# Altium project miniBackplane_test.PrjPCB
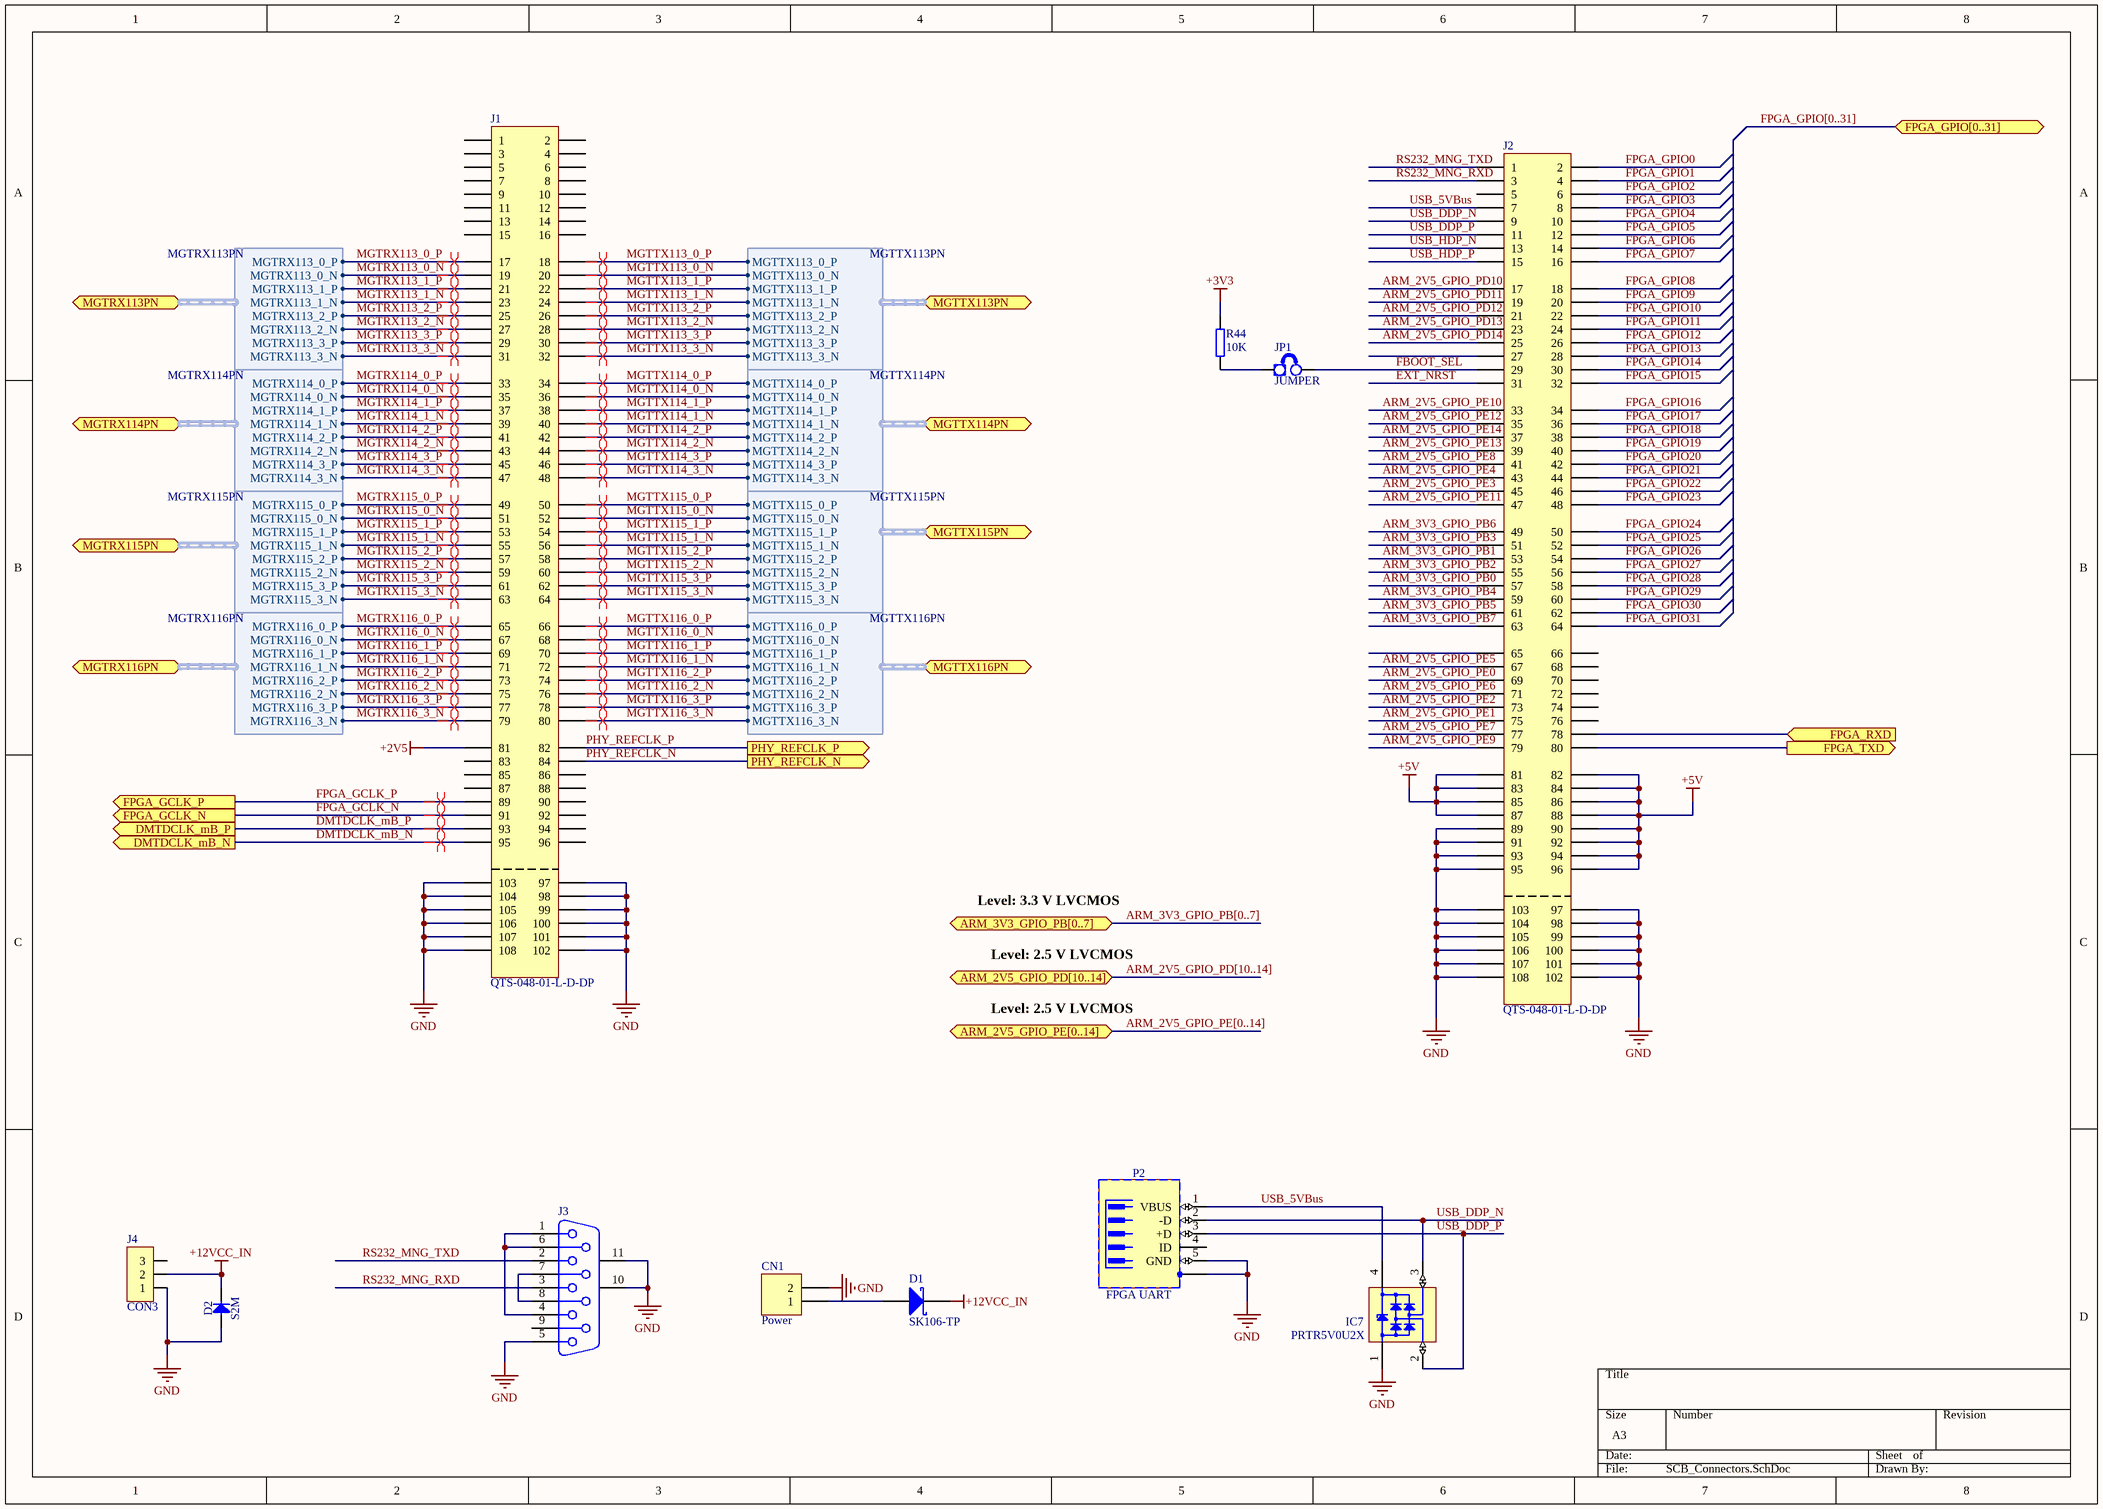
[diagram p0: SCB_Connectors.SchDoc]
3 sheets, 48 parts. Net scope: hierarchical (ports join the sheet entries above them; power ports are global).
Sheets:
  SCB_Connectors.SchDoc
  Power_Supply.SchDoc
  WR_Mezzanine.SchDoc

## Sheet SCB_Connectors.SchDoc
size A3

### Parts
CN1  Power  [TYCO_794120_1]
D1  SK106-TP  [DIOM7959X262N]
D2  S2M  [DO-214AA/SMB]
IC7  PRTR5V0U2X  [SOT190P230X110-4N]
J1  QTS-048-01-L-D-DP  [QTS-048-XX-X-D-DP-A]
J2  QTS-048-01-L-D-DP  [QTS-048-XX-X-D-DP-A]
J3  D Connector 9  [DSUB1.385-2H9]  (value not drawn)
J4  CON3  [MOLEX_22-11-2032]
JP1  JUMPER  [con_1x2_1.27]
P2  FPGA UART  [TYCO_1734035-1]
R44  10K  [0603]

### Ports
ARM_2V5_GPIO_PD[10..14] (bidir), ARM_2V5_GPIO_PE[0..14] (bidir), ARM_3V3_GPIO_PB[0..7] (bidir), DMTDCLK_mB_N (out), DMTDCLK_mB_P (out), FPGA_GCLK_N (out), FPGA_GCLK_P (out), FPGA_GPIO[0..31] (bidir), FPGA_RXD (in), FPGA_TXD (out), MGTRX113PN (harness MGTRX113PN), MGTRX114PN (harness MGTRX114PN), MGTRX115PN (harness MGTRX115PN), MGTRX116PN (harness MGTRX116PN), MGTTX113PN (harness MGTTX113PN), MGTTX114PN (harness MGTTX114PN), MGTTX115PN (harness MGTTX115PN), MGTTX116PN (harness MGTTX116PN), PHY_REFCLK_N (out), PHY_REFCLK_P (out)

### Harnesses
MGTRX113PN: MGTRX113_0_P, MGTRX113_0_N, MGTRX113_1_P, MGTRX113_1_N, MGTRX113_2_P, MGTRX113_2_N, MGTRX113_3_P, MGTRX113_3_N
MGTRX114PN: MGTRX114_0_P, MGTRX114_0_N, MGTRX114_1_P, MGTRX114_1_N, MGTRX114_2_P, MGTRX114_2_N, MGTRX114_3_P, MGTRX114_3_N
MGTRX115PN: MGTRX115_0_P, MGTRX115_0_N, MGTRX115_1_P, MGTRX115_1_N, MGTRX115_2_P, MGTRX115_2_N, MGTRX115_3_P, MGTRX115_3_N
MGTRX116PN: MGTRX116_0_P, MGTRX116_0_N, MGTRX116_1_P, MGTRX116_1_N, MGTRX116_2_P, MGTRX116_2_N, MGTRX116_3_P, MGTRX116_3_N
MGTTX113PN: MGTTX113_0_P, MGTTX113_0_N, MGTTX113_1_P, MGTTX113_1_N, MGTTX113_2_P, MGTTX113_2_N, MGTTX113_3_P, MGTTX113_3_N
MGTTX114PN: MGTTX114_0_P, MGTTX114_0_N, MGTTX114_1_P, MGTTX114_1_N, MGTTX114_2_P, MGTTX114_2_N, MGTTX114_3_P, MGTTX114_3_N
MGTTX115PN: MGTTX115_0_P, MGTTX115_0_N, MGTTX115_1_P, MGTTX115_1_N, MGTTX115_2_P, MGTTX115_2_N, MGTTX115_3_P, MGTTX115_3_N
MGTTX116PN: MGTTX116_0_P, MGTTX116_0_N, MGTTX116_1_P, MGTTX116_1_N, MGTTX116_2_P, MGTTX116_2_N, MGTTX116_3_P, MGTTX116_3_N

### Nets
+2V5: J1.81
+3V3: R44.2
+5V: J2.81 J2.82 J2.83 J2.84 J2.85 J2.86 J2.87 J2.88 J2.90 J2.92 J2.94 J2.96
+12VCC_IN: D1.2(K) D2.1(C) J4.2
GND: CN1.2 D2.2(A) IC7.1(GND) J1.97 J1.98 J1.99 J1.100 J1.101 J1.102 J1.103 J1.104 J1.105 J1.106 J1.107 J1.108 J2.89 J2.91 J2.93 J2.95 J2.97 J2.98 J2.99 J2.100 J2.101 J2.102 J2.103 J2.104 J2.105 J2.106 J2.107 J2.108 J3.5 J3.10(MH1) J3.11(MH2) J4.1 P2.5(GND) P2.6(SH)
ARM_2V5_GPIO_PD10: J2.17
ARM_2V5_GPIO_PD11: J2.19
ARM_2V5_GPIO_PD12: J2.21
ARM_2V5_GPIO_PD13: J2.23
ARM_2V5_GPIO_PD14: J2.25
ARM_2V5_GPIO_PE0: J2.69
ARM_2V5_GPIO_PE1: J2.75
ARM_2V5_GPIO_PE2: J2.73
ARM_2V5_GPIO_PE3: J2.45
ARM_2V5_GPIO_PE4: J2.43
ARM_2V5_GPIO_PE5: J2.67
ARM_2V5_GPIO_PE6: J2.71
ARM_2V5_GPIO_PE7: J2.77
ARM_2V5_GPIO_PE8: J2.41
ARM_2V5_GPIO_PE9: J2.79
ARM_2V5_GPIO_PE10: J2.33
ARM_2V5_GPIO_PE11: J2.47
ARM_2V5_GPIO_PE12: J2.35
ARM_2V5_GPIO_PE13: J2.39
ARM_2V5_GPIO_PE14: J2.37
ARM_3V3_GPIO_PB0: J2.57
ARM_3V3_GPIO_PB1: J2.53
ARM_3V3_GPIO_PB2: J2.55
ARM_3V3_GPIO_PB3: J2.51
ARM_3V3_GPIO_PB4: J2.59
ARM_3V3_GPIO_PB5: J2.61
ARM_3V3_GPIO_PB6: J2.49
ARM_3V3_GPIO_PB7: J2.63
DMTDCLK_mB_N: J1.95 ; port DMTDCLK_mB_N
DMTDCLK_mB_P: J1.93 ; port DMTDCLK_mB_P
EXT_NRST: J2.31
FBOOT_SEL: J2.29 JP1.2(E2)
FPGA_GCLK_N: J1.91 ; port FPGA_GCLK_N
FPGA_GCLK_P: J1.89 ; port FPGA_GCLK_P
FPGA_GPIO0: J2.2
FPGA_GPIO1: J2.4
FPGA_GPIO2: J2.6
FPGA_GPIO3: J2.8
FPGA_GPIO4: J2.10
FPGA_GPIO5: J2.12
FPGA_GPIO6: J2.14
FPGA_GPIO7: J2.16
FPGA_GPIO8: J2.18
FPGA_GPIO9: J2.20
FPGA_GPIO10: J2.22
FPGA_GPIO11: J2.24
FPGA_GPIO12: J2.26
FPGA_GPIO13: J2.28
FPGA_GPIO14: J2.30
FPGA_GPIO15: J2.32
FPGA_GPIO16: J2.34
FPGA_GPIO17: J2.36
FPGA_GPIO18: J2.38
FPGA_GPIO19: J2.40
FPGA_GPIO20: J2.42
FPGA_GPIO21: J2.44
FPGA_GPIO22: J2.46
FPGA_GPIO23: J2.48
FPGA_GPIO24: J2.50
FPGA_GPIO25: J2.52
FPGA_GPIO26: J2.54
FPGA_GPIO27: J2.56
FPGA_GPIO28: J2.58
FPGA_GPIO29: J2.60
FPGA_GPIO30: J2.62
FPGA_GPIO31: J2.64
MGTRX113_0_N: J1.19 ; port MGTRX113PN.MGTRX113_0_N
MGTRX113_0_P: J1.17 ; port MGTRX113PN.MGTRX113_0_P
MGTRX113_1_N: J1.23 ; port MGTRX113PN.MGTRX113_1_N
MGTRX113_1_P: J1.21 ; port MGTRX113PN.MGTRX113_1_P
MGTRX113_2_N: J1.27 ; port MGTRX113PN.MGTRX113_2_N
MGTRX113_2_P: J1.25 ; port MGTRX113PN.MGTRX113_2_P
MGTRX113_3_N: J1.31 ; port MGTRX113PN.MGTRX113_3_N
MGTRX113_3_P: J1.29 ; port MGTRX113PN.MGTRX113_3_P
MGTRX114_0_N: J1.35 ; port MGTRX114PN.MGTRX114_0_N
MGTRX114_0_P: J1.33 ; port MGTRX114PN.MGTRX114_0_P
MGTRX114_1_N: J1.39 ; port MGTRX114PN.MGTRX114_1_N
MGTRX114_1_P: J1.37 ; port MGTRX114PN.MGTRX114_1_P
MGTRX114_2_N: J1.43 ; port MGTRX114PN.MGTRX114_2_N
MGTRX114_2_P: J1.41 ; port MGTRX114PN.MGTRX114_2_P
MGTRX114_3_N: J1.47 ; port MGTRX114PN.MGTRX114_3_N
MGTRX114_3_P: J1.45 ; port MGTRX114PN.MGTRX114_3_P
MGTRX115_0_N: J1.51 ; port MGTRX115PN.MGTRX115_0_N
MGTRX115_0_P: J1.49 ; port MGTRX115PN.MGTRX115_0_P
MGTRX115_1_N: J1.55 ; port MGTRX115PN.MGTRX115_1_N
MGTRX115_1_P: J1.53 ; port MGTRX115PN.MGTRX115_1_P
MGTRX115_2_N: J1.59 ; port MGTRX115PN.MGTRX115_2_N
MGTRX115_2_P: J1.57 ; port MGTRX115PN.MGTRX115_2_P
MGTRX115_3_N: J1.63 ; port MGTRX115PN.MGTRX115_3_N
MGTRX115_3_P: J1.61 ; port MGTRX115PN.MGTRX115_3_P
MGTRX116_0_N: J1.67 ; port MGTRX116PN.MGTRX116_0_N
MGTRX116_0_P: J1.65 ; port MGTRX116PN.MGTRX116_0_P
MGTRX116_1_N: J1.71 ; port MGTRX116PN.MGTRX116_1_N
MGTRX116_1_P: J1.69 ; port MGTRX116PN.MGTRX116_1_P
MGTRX116_2_N: J1.75 ; port MGTRX116PN.MGTRX116_2_N
MGTRX116_2_P: J1.73 ; port MGTRX116PN.MGTRX116_2_P
MGTRX116_3_N: J1.79 ; port MGTRX116PN.MGTRX116_3_N
MGTRX116_3_P: J1.77 ; port MGTRX116PN.MGTRX116_3_P
MGTTX113_0_N: J1.20 ; port MGTTX113PN.MGTTX113_0_N
MGTTX113_0_P: J1.18 ; port MGTTX113PN.MGTTX113_0_P
MGTTX113_1_N: J1.24 ; port MGTTX113PN.MGTTX113_1_N
MGTTX113_1_P: J1.22 ; port MGTTX113PN.MGTTX113_1_P
MGTTX113_2_N: J1.28 ; port MGTTX113PN.MGTTX113_2_N
MGTTX113_2_P: J1.26 ; port MGTTX113PN.MGTTX113_2_P
MGTTX113_3_N: J1.32 ; port MGTTX113PN.MGTTX113_3_N
MGTTX113_3_P: J1.30 ; port MGTTX113PN.MGTTX113_3_P
MGTTX114_0_N: J1.36 ; port MGTTX114PN.MGTTX114_0_N
MGTTX114_0_P: J1.34 ; port MGTTX114PN.MGTTX114_0_P
MGTTX114_1_N: J1.40 ; port MGTTX114PN.MGTTX114_1_N
MGTTX114_1_P: J1.38 ; port MGTTX114PN.MGTTX114_1_P
MGTTX114_2_N: J1.44 ; port MGTTX114PN.MGTTX114_2_N
MGTTX114_2_P: J1.42 ; port MGTTX114PN.MGTTX114_2_P
MGTTX114_3_N: J1.48 ; port MGTTX114PN.MGTTX114_3_N
MGTTX114_3_P: J1.46 ; port MGTTX114PN.MGTTX114_3_P
MGTTX115_0_N: J1.52 ; port MGTTX115PN.MGTTX115_0_N
MGTTX115_0_P: J1.50 ; port MGTTX115PN.MGTTX115_0_P
MGTTX115_1_N: J1.56 ; port MGTTX115PN.MGTTX115_1_N
MGTTX115_1_P: J1.54 ; port MGTTX115PN.MGTTX115_1_P
MGTTX115_2_N: J1.60 ; port MGTTX115PN.MGTTX115_2_N
MGTTX115_2_P: J1.58 ; port MGTTX115PN.MGTTX115_2_P
MGTTX115_3_N: J1.64 ; port MGTTX115PN.MGTTX115_3_N
MGTTX115_3_P: J1.62 ; port MGTTX115PN.MGTTX115_3_P
MGTTX116_0_N: J1.68 ; port MGTTX116PN.MGTTX116_0_N
MGTTX116_0_P: J1.66 ; port MGTTX116PN.MGTTX116_0_P
MGTTX116_1_N: J1.72 ; port MGTTX116PN.MGTTX116_1_N
MGTTX116_1_P: J1.70 ; port MGTTX116PN.MGTTX116_1_P
MGTTX116_2_N: J1.76 ; port MGTTX116PN.MGTTX116_2_N
MGTTX116_2_P: J1.74 ; port MGTTX116PN.MGTTX116_2_P
MGTTX116_3_N: J1.80 ; port MGTTX116PN.MGTTX116_3_N
MGTTX116_3_P: J1.78 ; port MGTTX116PN.MGTTX116_3_P
PHY_REFCLK_N: J1.84 ; port PHY_REFCLK_N
PHY_REFCLK_P: J1.82 ; port PHY_REFCLK_P
RS232_MNG_RXD: J2.3 J3.3
RS232_MNG_TXD: J2.1 J3.2
USB_5VBus: IC7.4(VCC) J2.7 P2.1(VBUS)
USB_DDP_N: IC7.3(I/O2) J2.9 P2.2(-D)
USB_DDP_P: IC7.2(I/O1) J2.11 P2.3(+D)
USB_HDP_N: J2.13
USB_HDP_P: J2.15
NetCN1_1: CN1.1 D1.1(A)
NetJ2_78: J2.78 ; port FPGA_RXD
NetJ2_80: J2.80 ; port FPGA_TXD
NetJ3_1: J3.1 J3.4 J3.6
NetJ3_7: J3.7 J3.8
NetJP1_1: JP1.1(E1) R44.1

Not connected (* = marked no-connect by the designer): J1 1 2 3 4 5 6 7 8 9 10 11 12 13 14 15 16 83 85 86 87 88 90 92 94 96; J2 5 27 65 66 68 70 72 74 76; J3 9; J4 3; P2 4(ID)

### Buses and harness runs
bus ARM_2V5_GPIO_PD[10..14] = port ARM_2V5_GPIO_PD[10..14]
bus ARM_2V5_GPIO_PE[0..14] = port ARM_2V5_GPIO_PE[0..14]
bus ARM_3V3_GPIO_PB[0..7] = port ARM_3V3_GPIO_PB[0..7]
bus FPGA_GPIO[0..31] = port FPGA_GPIO[0..31]

### Layout directives
differential pair: DMTDCLK_mB_N, DMTDCLK_mB_P, FPGA_GCLK_N, FPGA_GCLK_P, MGTRX113_0_N, MGTRX113_0_P, MGTRX113_1_N, MGTRX113_1_P, MGTRX113_2_N, MGTRX113_2_P, MGTRX113_3_N, MGTRX113_3_P, MGTRX114_0_N, MGTRX114_0_P, MGTRX114_1_N, MGTRX114_1_P, MGTRX114_2_N, MGTRX114_2_P, MGTRX114_3_N, MGTRX114_3_P, MGTRX115_0_N, MGTRX115_0_P, MGTRX115_1_N, MGTRX115_1_P, MGTRX115_2_N, MGTRX115_2_P, MGTRX115_3_N, MGTRX115_3_P, MGTRX116_0_N, MGTRX116_0_P, MGTRX116_1_N, MGTRX116_1_P, MGTRX116_2_N, MGTRX116_2_P, MGTRX116_3_N, MGTRX116_3_P, MGTTX113_0_N, MGTTX113_0_P, MGTTX113_1_N, MGTTX113_1_P, MGTTX113_2_N, MGTTX113_2_P, MGTTX113_3_N, MGTTX113_3_P, MGTTX114_0_N, MGTTX114_0_P, MGTTX114_1_N, MGTTX114_1_P, MGTTX114_2_N, MGTTX114_2_P, MGTTX114_3_N, MGTTX114_3_P, MGTTX115_0_N, MGTTX115_0_P, MGTTX115_1_N, MGTTX115_1_P, MGTTX115_2_N, MGTTX115_2_P, MGTTX115_3_N, MGTTX115_3_P, MGTTX116_0_N, MGTTX116_0_P, MGTTX116_1_N, MGTTX116_1_P, MGTTX116_2_N, MGTTX116_2_P, MGTTX116_3_N, MGTTX116_3_P

### Notes on the sheet
- Level: 3.3 V LVCMOS
- Level: 2.5 V LVCMOS

### Library data of the parts
CN1 = Header 2: Header, 2-Pin; Manufacturer1 PN: 794120-1; Manufacturer1: Tyco Electronics; LatestRevisionDate: 17-Jul-2002; LatestRevisionNote: Re-released for DXP Platform.; Publisher: Altium Limited; Distributor1: Digikey; Distributor1 PN: A25753-ND
D1 = SK106-TP: Schottky Diode 10A 60V; Manufacturer1: Micro Commercial Components; Distributor1 PN: Digikey; Manufacturer1 PN: SK106-TP; Distributor1 PN: SK106-TPCT-ND
D2 = S2M: Diode; Part Description: General Purpose Rectifiers (Glass Passivated); Manufacturer: FAIRCHILD SEMICONDUCTOR; Voltage: 1000V; Power: 2A; Table: Diodes; Part Number: S2M; Component Kind: Standard; Component Type: Standard; Device: S2M; Footprint: DIOM5336X265N; PackageDescription: DO-214-AA/SMB Diode, Molded Body; 5.34mm L X 3.625mm W X 2.65mm H, IPC Medium Density; Manufacturer Part Number: S2M; Pin Count: 2; Case: DO-214AA; Mounted: Yes; Socket: No; SMD: Yes; ComponentHeight: 2.65mm; HelpURL: \\cern.ch\dfs\Applications\Altium\Datasheets\S2M.pdf; Author: CERN DEM JLC; CreateDate: 4/26/2011; LatestRevisionDate: 4/26/2011
IC7 = PRTR5V0U2X: Ultra Low Capacitance Double Rail-to-Rail ESD Protection Diode; Part Description: Ultra Low Capacitance (1pF) Double Rail-to-Rail ESD Protection Diode (8kV); Manufacturer: PHILIPS NXP; Voltage: 5.5V; Table: Diodes; Part Number: PRTR5V0U2X; Component Kind: Standard; Component Type: Standard; Device: PRTR5V0U2X; PackageDescription: SOT143B, SOT, 1.90mm Pitch; 4 Pin, 1.30mm W X 2.90mm L X 1.10mm H body, IPC Medium Density; Manufacturer Part Number: PRTR5V0U2X; Pin Count: 4; Case: SOT143B; Mounted: Yes; Socket: No; SMD: Yes; ComponentHeight: 1.1mm; HelpURL: \\cern.ch\dfs\Applications\Altium\Datasheets\PRTR5V0U2X.pdf; Author: CERN DEM JLC; CreateDate: 3/22/2011; LatestRevisionDate: 3/22/2011
J1 J2 = QTS-048-01-L-D-DP: High Speed Ground Plane Header; Manufacturer1: Samtec; Manufacturer1 PN: QTS-048-01-L-D-DP
J3 = D Connector 9: Receptacle Assembly, 9 Position, Right Angle; Manufacturer1 PN: 1734348-1; Manufacturer1: TE Connectivity; PackageDocument: O; Positions: 9; Published: 15-Jun-2001; LatestRevisionDate: 17-Jul-2002; LatestRevisionNote: Re-released for DXP Platform.; DatasheetDocument: 1-Sep-1999; PackageReference: 788750; Publisher: Altium Limited; Orientation: Right Angle; Gender: Receptacle; Distributor1: Digikey; Distributor1 PN: A35109-ND
J4 = CON3: Connector; Manufacturer1: Molex; Distributor1: Digikey; Distributor1 PN: WM2701-ND; Manufacturer1 PN: 22-11-2032
P2 = TYCO_1734035-1: 5 Pin + 1 Shield USB Receptacle; Part Description: 5 Position, Right Angle, SMD Mini USB Type B Receptacle; Manufacturer: TYCO ELECTRONICS; Table: TYCO; Part Number: TYCO_1734035-1; Component Kind: Standard; Component Type: Standard; Pin Count: 6; Family: USB; Mounted: Yes; Socket: No; SMD: Yes; Status: None; Manufacturer Part Number: 1734035-1; ComponentHeight: 3.95mm; HelpURL: \\cern.ch\dfs\Applications\Altium\Datasheets\TYCO_1734035-1.pdf; Author: CERN DEM JLC; CreateDate: 02/05/2011; LatestRevisionDate: 02/05/2011
R44 = R0603_10K_±1%_0.2W_100PPM: SMD Resistor; Manufacturer1: Rohm; Manufacturer1 PN: ESR03EZPF1002; TCR: 100ppm; Power Rating: 0.2W; Tolerance: ±1%; Case: 0603; Distributor1: DigiKey; Distributor1 PN: RHM10KADCT-ND; Value: 10K

## Sheet Power_Supply.SchDoc
size A4
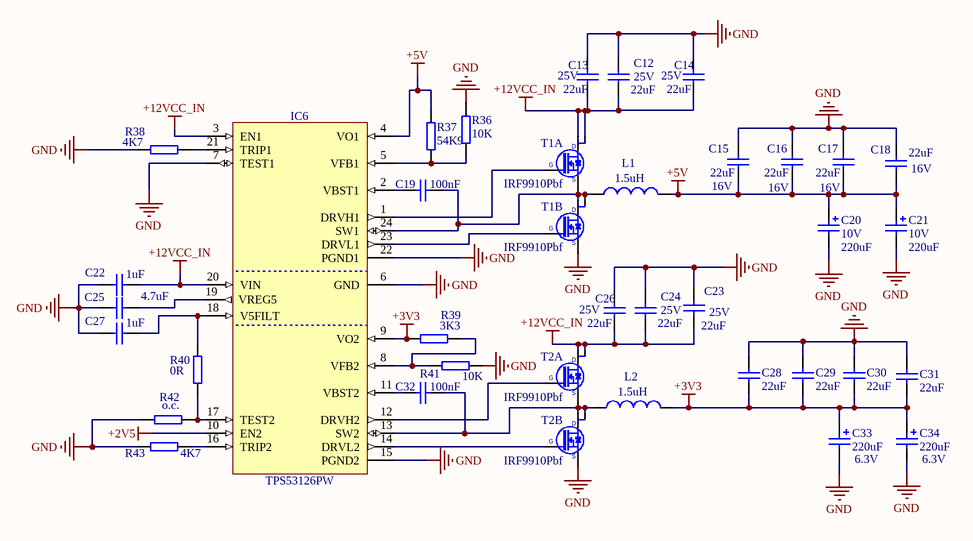
[diagram p1: Power_Supply.SchDoc]

### Parts
C12  value 22uF  Voltage: 25V  [CC3216-1206]  (hidden comment: 22uF 25V)
C13  value 22uF  Voltage: 25V  [CC3216-1206]  (hidden comment: 22uF 25V)
C14  value 22uF  Voltage: 25V  [CC3216-1206]  (hidden comment: 22uF 25V)
C15  value 22uF  Voltage: 16V  [CC2012-0805]  (hidden comment: 22uF 16V)
C16  value 22uF  Voltage: 16V  [CC2012-0805]  (hidden comment: 22uF 16V)
C17  value 22uF  Voltage: 16V  [CC2012-0805]  (hidden comment: 22uF 16V)
C18  value 22uF  Voltage: 16V  [CC2012-0805]  (hidden comment: 22uF 16V)
C19  100nF  [CC1608-0603]
C20  value 220uF  Voltage: 10V  [D]  (hidden comment: 220uF 10V)
C21  value 220uF  Voltage: 10V  [D]  (hidden comment: 220uF 10V)
C22  1uF  [CC1608-0603]
C23  value 22uF  Voltage: 25V  [CC3216-1206]  (hidden comment: 22uF 25V)
C24  value 22uF  Voltage: 25V  [CC3216-1206]  (hidden comment: 22uF 25V)
C25  4.7uF  [CC1608-0603]
C26  value 22uF  Voltage: 25V  [CC3216-1206]  (hidden comment: 22uF 25V)
C27  1uF  [CC1608-0603]
C28  22uF  [CC2012-0805]
C29  22uF  [CC2012-0805]
C30  22uF  [CC2012-0805]
C31  22uF  [CC2012-0805]
C32  100nF  [CC1608-0603]
C33  Voltage: 6.3V  [D]  (hidden comment: 220uF)
C34  Voltage: 6.3V  [D]  (hidden comment: 220uF)
IC6  TPS53126PW  [SOP65P640X120-24N]
L1  value 1.5uH  [IHLP2525]  (hidden comment: IHLP2525CZER1R5M01)
L2  value 1.5uH  [IHLP2525]  (hidden comment: IHLP2525CZER1R5M01)
R36  10K  [0603]
R37  54K9  [0603]
R38  4K7  [0603]
R39  3K3  [0603]
R40  0R  [0603]
R41  10K  [0603]
R42  o.c.  [0603]
R43  4K7  [0603]
T1  IRF9910Pbf  [SOIC127P600X175-8N]  (parts A,B of 2)
T2  IRF9910Pbf  [SOIC127P600X175-8N]  (parts A,B of 2)

### Nets
+2V5: IC6.10(EN2)
+3V3: C28.2 C29.1 C30.1 C31.1 C33.1 C34.1 IC6.9(VO2) L2.2 R39.1
+5V: C15.1 C16.1 C17.1 C18.1 C20.1 C21.1 IC6.4(VO1) L1.2 R37.2
+12VCC_IN: C12.1 C13.1 C14.1 C22.2 C23.1 C24.1 C26.1 IC6.3(EN1) IC6.20(VIN) T1.5(D) T1.6(D) T2.5(D) T2.6(D)
GND: C12.2 C13.2 C14.2 C15.2 C16.2 C17.2 C18.2 C20.2 C21.2 C22.1 C23.2 C24.2 C25.2 C26.2 C27.1 C28.1 C29.2 C30.2 C31.2 C33.2 C34.2 IC6.6(GND) IC6.7(TEST1) IC6.15(PGND2) IC6.22(PGND1) R36.2 R38.2 R41.1 R42.2 R43.2 T1.1(S) T2.1(S)
NetC19_1: C19.1 IC6.24(SW1) L1.1 T1.3(S) T1.7(D) T1.8(D)
NetC19_2: C19.2 IC6.2(VBST1)
NetC25_1: C25.1 IC6.19(VREG5)
NetC27_2: C27.2 IC6.18(V5FILT) R40.1
NetC32_1: C32.1 IC6.13(SW2) L2.1 T2.3(S) T2.7(D) T2.8(D)
NetC32_2: C32.2 IC6.11(VBST2)
NetIC6_1: IC6.1(DRVH1) T1.4(G)
NetIC6_5: IC6.5(VFB1) R36.1 R37.1
NetIC6_8: IC6.8(VFB2) R39.2 R41.2
NetIC6_12: IC6.12(DRVH2) T2.4(G)
NetIC6_14: IC6.14(DRVL2) T2.2(G)
NetIC6_16: IC6.16(TRIP2) R43.1
NetIC6_17: IC6.17(TEST2) R40.2 R42.1
NetIC6_21: IC6.21(TRIP1) R38.1
NetIC6_23: IC6.23(DRVL1) T1.2(G)

### Library data of the parts
C12-C14 C23 C24 C26 = CC1206_22UF_25V_10%_X5R: Capacitor; Manufacturer1: Murata; Manufacturer1 PN: GRM31CR61E226KE15L; TC: X5R; Tolerance: ±10%; Published: 8-Jun-2000; LatestRevisionDate: 17-Jul-2002; LatestRevisionNote: Re-released for DXP Platform.; PackageReference: RAD-0.3; Publisher: Altium Limited; Distributor1: Digikey; Distributor1 PN: 490-5527-1-ND; Case: 1206
C15-C18 = CC0805_22UF_16V_10%_X5R: Capacitor; Manufacturer1: Phycomp; Manufacturer1 PN: C2012X5R1C226K; TC: X7R; Tolerance: ±10%; Published: 8-Jun-2000; LatestRevisionDate: 17-Jul-2002; LatestRevisionNote: Re-released for DXP Platform.; PackageReference: RAD-0.3; Publisher: Altium Limited; Distributor1: Digikey; Distributor1 PN: 445-6797-1-ND; Case: 0805
C19 C32 = CC0603_100NF_16V_10%_X7R: Capacitor; Manufacturer1: AVX; Manufacturer1 PN: 0603YC104KAT2A; TC: X7R; Tolerance: ±10%; Voltage: 16V; Published: 8-Jun-2000; LatestRevisionDate: 17-Jul-2002; LatestRevisionNote: Re-released for DXP Platform.; PackageReference: RAD-0.3; Publisher: Altium Limited; Distributor1: Digikey; Distributor1 PN: 478-1239-1-ND; Case: 0603; Value: 100nF
C20 C21 = CP2917_220UF_10V_20%_TANT: Polarized Capacitor Tantalum; Manufacturer1: Kemet; Manufacturer1 PN: T520D227M010ATE018; Tolerance: ±20%; ESR: 18mOhm; Published: 8-Jun-2000; LatestRevisionDate: 17-Jul-2002; LatestRevisionNote: Re-released for DXP Platform.; PackageReference: RB7.6-15; Publisher: Altium Limited; Case: 2917; Distributor1: Digikey; Distributor1 PN: 399-4045-1-ND; TC: Tantalum
C22 C27 = CC0603_1UF_25V_10%_X5R: Capacitor; Manufacturer1: Phycomp; Manufacturer1 PN: GRM188R61E105KA12D; TC: X5R; Tolerance: ±10%; Voltage: 25V; Published: 8-Jun-2000; LatestRevisionDate: 17-Jul-2002; LatestRevisionNote: Re-released for DXP Platform.; Publisher: Altium Limited; Distributor1: Digikey; Distributor1 PN: 490-3897-1-ND; Case: 0603; Value: 1uF
C25 = CC0603_4.7UF_10V_10%_X5R: Capacitor; Manufacturer1: TDK; Manufacturer1 PN: C1608X5R1A475K; TC: X5R; Tolerance: ±10%; Voltage: 10V; Published: 8-Jun-2000; LatestRevisionDate: 17-Jul-2002; LatestRevisionNote: Re-released for DXP Platform.; PackageReference: RAD-0.3; Publisher: Altium Limited; Distributor1: Digikey; Distributor1 PN: 445-5170-1-ND; Case: 0603; Value: 4.7uF
C28-C31 = CC0805_22UF_6.3V_20%_X5R: Capacitor; Manufacturer1: TDK; Manufacturer1 PN: C2012X5R0J226M; TC: X5R; Tolerance: ±20%; Voltage: 6.3V; Published: 8-Jun-2000; LatestRevisionDate: 17-Jul-2002; LatestRevisionNote: Re-released for DXP Platform.; PackageReference: RAD-0.3; Publisher: Altium Limited; Distributor1: Digikey; Distributor1 PN: 445-1422-1-ND; Case: 0805; Value: 22uF
C33 C34 = CP2917_220UF_6.3V_20%_TANT: Polarized Capacitor Tantalum; Manufacturer1: Kemet; Manufacturer1 PN: T520D227M006ATE009; Tolerance: ±20%; ESR: 9mOhm; Published: 8-Jun-2000; LatestRevisionDate: 17-Jul-2002; LatestRevisionNote: Re-released for DXP Platform.; PackageReference: RB7.6-15; Publisher: Altium Limited; Case: 2917; Distributor1: Digikey; Distributor1 PN: T520D227M006ATE009; TC: Tantalum; Value: 220uF
IC6 = TPS53126PW: Dual Synchronous Step-Down Controller For Low Voltage Power Rails; Manufacturer: TEXAS INSTRUMENTS; Table: Analog & Interface; Part Number: TPS53126PW; Component Kind: Standard; Component Type: Standard; Device: TPS53126PW; PackageDescription: SOP, 0.65mm Pitch; 24 Pin, 4.40mm W X 7.80mm L X 1.20mm H Body, IPC Medium Density; Part Description: Dual Synchronous Step-Down Controller For Low Voltage Power Rails; Manufacturer Part Number: TPS53126PW; Pin Count: 24; Case: QFN24; Mounted: Yes; Socket: No; SMD: Yes; ComponentHeight: 1.0mm; Author: CERN DEM JLC; HelpURL: \\cern.ch\dfs\Applications\Altium\Datasheets\TPS53126RGET.pdf; CreateDate: 2010-08-26; LatestRevisionDate: 2010-08-26; Distributor1: Digikey; Distributor1 PN: 296-24555-1-ND
L1 L2 = Inductor: Low Profile, High Current Inductor; Manufacturer: Vishay/Dale; Published: 8-Jun-2000; Revision: July-2002: Re-released for DXP Platform.; Publisher: Altium Limited; Manufacturer PN: IHLP2525CZER1R5M01; Distributor1 PN: 541-1007-1-ND; Distributor1: Digikey
R36 R41 = R0603_10K_±1%_0.2W_100PPM: as R44 on sheet SCB_Connectors; Case: 0603; Distributor1: DigiKey; Distributor1 PN: RHM10KADCT-ND; Value: 10K
R37 = R0603_54K9_±1%_0.1W_100PPM: SMD Resistor; Manufacturer1: Panasonic; Manufacturer1 PN: ERJ-3EKF5492V; TCR: 100ppm; Power Rating: 0.1W; Tolerance: ±1%; Case: 0603; Distributor1: DigiKey; Distributor1 PN: P54.9KHCT-ND; Value: 54K9
R38 R43 = R0603_4.7K_±1%_0.1W_100PPM: SMD Resistor; Manufacturer1: Panasonic; Manufacturer1 PN: ERJ-3EKF4701V; TCR: 100ppm; Power Rating: 0.1W; Tolerance: ±1%; Case: 0603; Distributor1: DigiKey; Distributor1 PN: P4.70KHCT-ND; Value: 4K7
R39 = R0603_3K3_±1%_0.1W_100PPM: SMD Resistor; Manufacturer1: Yageo; Manufacturer1 PN: RC0603FR-073K3L; TCR: 100ppm; Power Rating: 0.1W; Tolerance: ±1%; Case: 0603; Distributor1: DigiKey; Distributor1 PN: 311-3.30KHRCT-ND; Value: 3K3
R40 = R0603_0R_0.1W_JUMPER: SMD Resistor; Manufacturer1: Yageo; Manufacturer1 PN: RC0603JR-070RL; TCR: 200ppm; Power Rating: 0.1W; Case: 0603; Distributor1: DigiKey; Distributor1 PN: 311-0.0GRCT-ND; Tolerance: -; Value: 0R
R42 = R0603_O.C.: SMD Resistor; Manufacturer1: NA; Case: 0603; Manufacturer1 PN: NA; Distributor1: NA; Distributor1 PN: NA; TCR: NA; Power Rating: NA; Tolerance: NA; Value: o.c.
T1 T2 = IRF9910Pbf: Dual SO-8 MOSFET For POL Cconverter; Part Description: 20V 10A(Q1) 20V 12A (Q2) Dual SO-8 MOSFET For POL Cconverter; Manufacturer: INTERNATIONAL RECTIFIER; Table: Transistors; Part Number: IRF9910Pbf; Component Kind: Standard; Component Type: Standard; Device: IRF9910Pbf; PackageDescription: SOIC 8, Pitch 1.27mm - Body 4x5mm, IPC Medium Density; Manufacturer Part Number: IRF9910Pbf; Pin Count: 8; Case: DO8; Mounted: Yes; Socket: No; SMD: Yes; ComponentHeight: 1.75mm; HelpURL: \\cern.ch\dfs\Applications\Altium\Datasheets\IRF9910Pbf.pdf; Author: CERN DEM JLC; CreateDate: 30/08/2010; LatestRevisionDate: 30/08/2010

## Sheet WR_Mezzanine.SchDoc
size A4
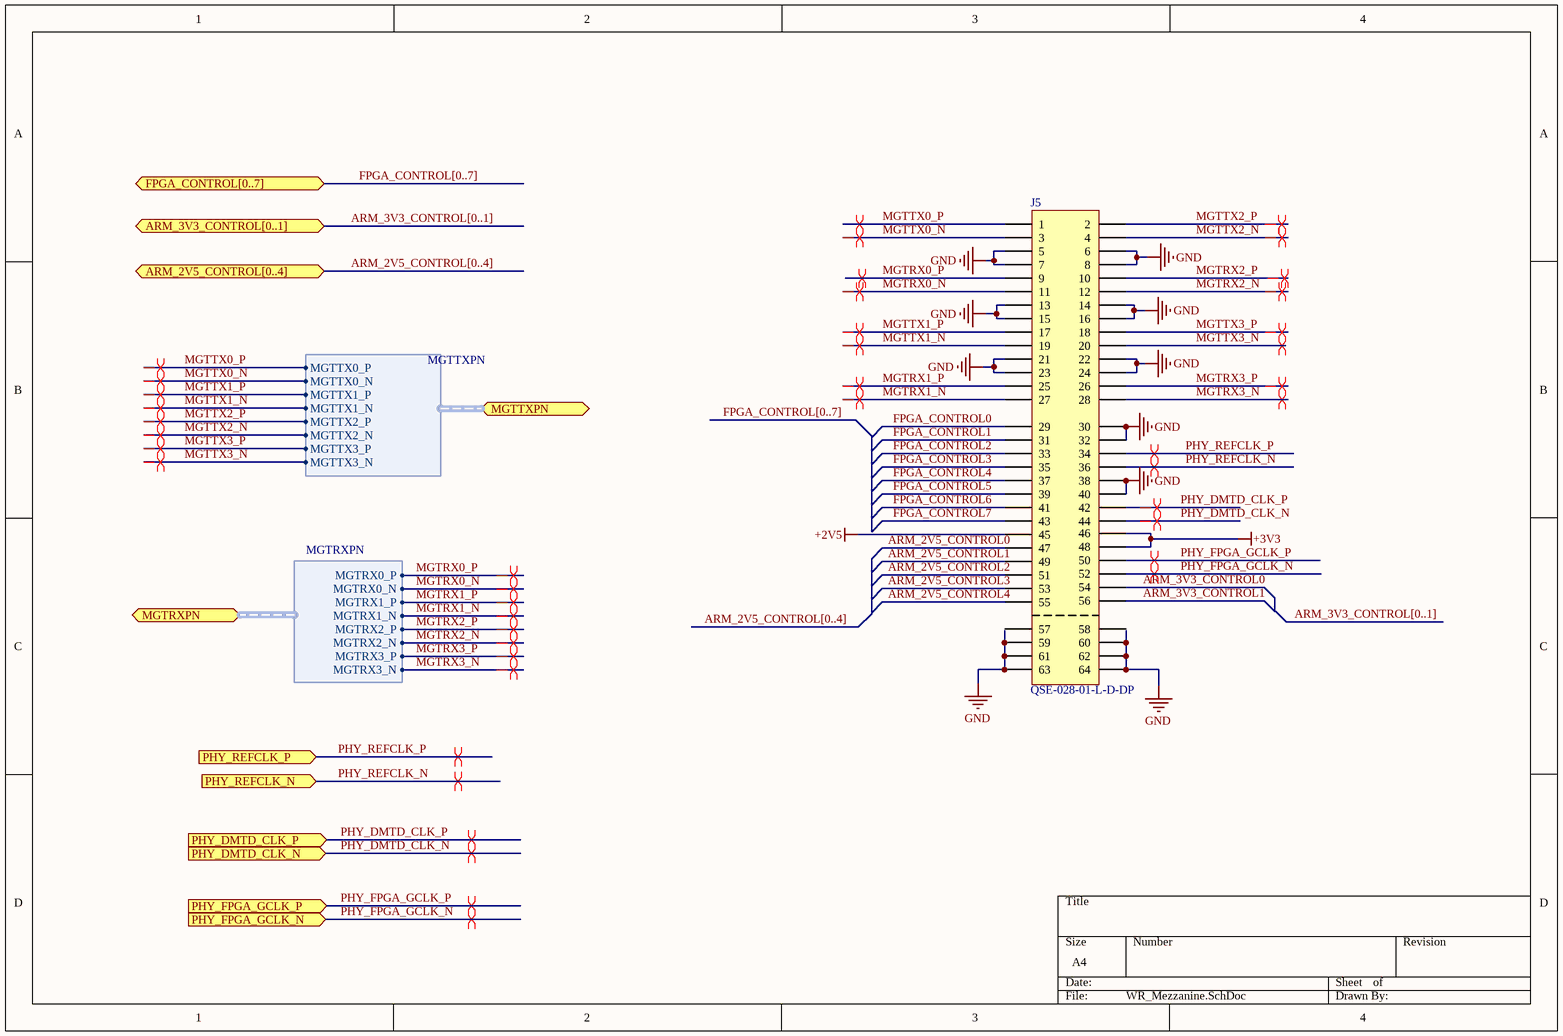
[diagram p2: WR_Mezzanine.SchDoc]

### Parts
J5  QSE-028-01-L-D-DP  [QSE-028-01-X-D-DP-A]

### Ports
ARM_2V5_CONTROL[0..4] (bidir), ARM_3V3_CONTROL[0..1] (bidir), FPGA_CONTROL[0..7] (bidir), MGTRXPN (harness MGTRXPN), MGTTXPN (harness MGTTXPN), PHY_DMTD_CLK_N (in), PHY_DMTD_CLK_P (in), PHY_FPGA_GCLK_N (in), PHY_FPGA_GCLK_P (in), PHY_REFCLK_N (in), PHY_REFCLK_P (in)

### Harnesses
MGTTXPN: MGTTX0_P, MGTTX0_N, MGTTX1_P, MGTTX1_N, MGTTX2_P, MGTTX2_N, MGTTX3_P, MGTTX3_N
MGTRXPN: MGTRX0_P, MGTRX0_N, MGTRX1_P, MGTRX1_N, MGTRX2_P, MGTRX2_N, MGTRX3_P, MGTRX3_N

### Nets
+2V5: J5.45
+3V3: J5.46 J5.48
GND: J5.5 J5.6 J5.7 J5.8 J5.13 J5.14 J5.15 J5.16 J5.21 J5.22 J5.23 J5.24 J5.30 J5.32 J5.38 J5.40 J5.59 J5.60 J5.61 J5.62 J5.63 J5.64
ARM_2V5_CONTROL0: J5.47
ARM_2V5_CONTROL1: J5.49
ARM_2V5_CONTROL2: J5.51
ARM_2V5_CONTROL3: J5.53
ARM_2V5_CONTROL4: J5.55
ARM_3V3_CONTROL0: J5.54
ARM_3V3_CONTROL1: J5.56
FPGA_CONTROL0: J5.29
FPGA_CONTROL1: J5.31
FPGA_CONTROL2: J5.33
FPGA_CONTROL3: J5.35
FPGA_CONTROL4: J5.37
FPGA_CONTROL5: J5.39
FPGA_CONTROL6: J5.41
FPGA_CONTROL7: J5.43
MGTRX0_N: J5.11 ; port MGTRXPN.MGTRX0_N
MGTRX0_P: J5.9 ; port MGTRXPN.MGTRX0_P
MGTRX1_N: J5.27 ; port MGTRXPN.MGTRX1_N
MGTRX1_P: J5.25 ; port MGTRXPN.MGTRX1_P
MGTRX2_N: J5.12 ; port MGTRXPN.MGTRX2_N
MGTRX2_P: J5.10 ; port MGTRXPN.MGTRX2_P
MGTRX3_N: J5.28 ; port MGTRXPN.MGTRX3_N
MGTRX3_P: J5.26 ; port MGTRXPN.MGTRX3_P
MGTTX0_N: J5.3 ; port MGTTXPN.MGTTX0_N
MGTTX0_P: J5.1 ; port MGTTXPN.MGTTX0_P
MGTTX1_N: J5.19 ; port MGTTXPN.MGTTX1_N
MGTTX1_P: J5.17 ; port MGTTXPN.MGTTX1_P
MGTTX2_N: J5.4 ; port MGTTXPN.MGTTX2_N
MGTTX2_P: J5.2 ; port MGTTXPN.MGTTX2_P
MGTTX3_N: J5.20 ; port MGTTXPN.MGTTX3_N
MGTTX3_P: J5.18 ; port MGTTXPN.MGTTX3_P
PHY_DMTD_CLK_N: J5.44 ; port PHY_DMTD_CLK_N
PHY_DMTD_CLK_P: J5.42 ; port PHY_DMTD_CLK_P
PHY_FPGA_GCLK_N: J5.52 ; port PHY_FPGA_GCLK_N
PHY_FPGA_GCLK_P: J5.50 ; port PHY_FPGA_GCLK_P
PHY_REFCLK_N: J5.36 ; port PHY_REFCLK_N
PHY_REFCLK_P: J5.34 ; port PHY_REFCLK_P

Not connected (* = marked no-connect by the designer): J5 57 58

### Buses and harness runs
bus ARM_2V5_CONTROL[0..4]
bus ARM_2V5_CONTROL[0..4] = port ARM_2V5_CONTROL[0..4]
bus ARM_3V3_CONTROL[0..1]
bus ARM_3V3_CONTROL[0..1] = port ARM_3V3_CONTROL[0..1]
bus FPGA_CONTROL[0..7]
bus FPGA_CONTROL[0..7] = port FPGA_CONTROL[0..7]

### Layout directives
differential pair: MGTRX0_N, MGTRX0_P, MGTRX1_N, MGTRX1_P, MGTRX2_N, MGTRX2_P, MGTRX3_N, MGTRX3_P, MGTTX0_N, MGTTX0_P, MGTTX1_N, MGTTX1_P, MGTTX2_N, MGTTX2_P, MGTTX3_N, MGTTX3_P, PHY_DMTD_CLK_N, PHY_DMTD_CLK_P, PHY_FPGA_GCLK_N, PHY_FPGA_GCLK_P, PHY_REFCLK_N, PHY_REFCLK_P

### Library data of the parts
J5 = QSE-028-01-L-D-DP: High Speed Ground Plane Header

## Nets that join several sheets
+2V5: SCB_Connectors (J1.81), Power_Supply (IC6.10), WR_Mezzanine (J5.45)
+3V3: SCB_Connectors (R44.2), Power_Supply (9 pins), WR_Mezzanine (J5.46 J5.48)
+5V: SCB_Connectors (12 pins), Power_Supply (9 pins)
+12VCC_IN: SCB_Connectors (D1.2 D2.1 J4.2), Power_Supply (13 pins)
GND: SCB_Connectors (37 pins), Power_Supply (32 pins), WR_Mezzanine (22 pins)